# Altium schematic sheet Calculator.SchDoc
size A
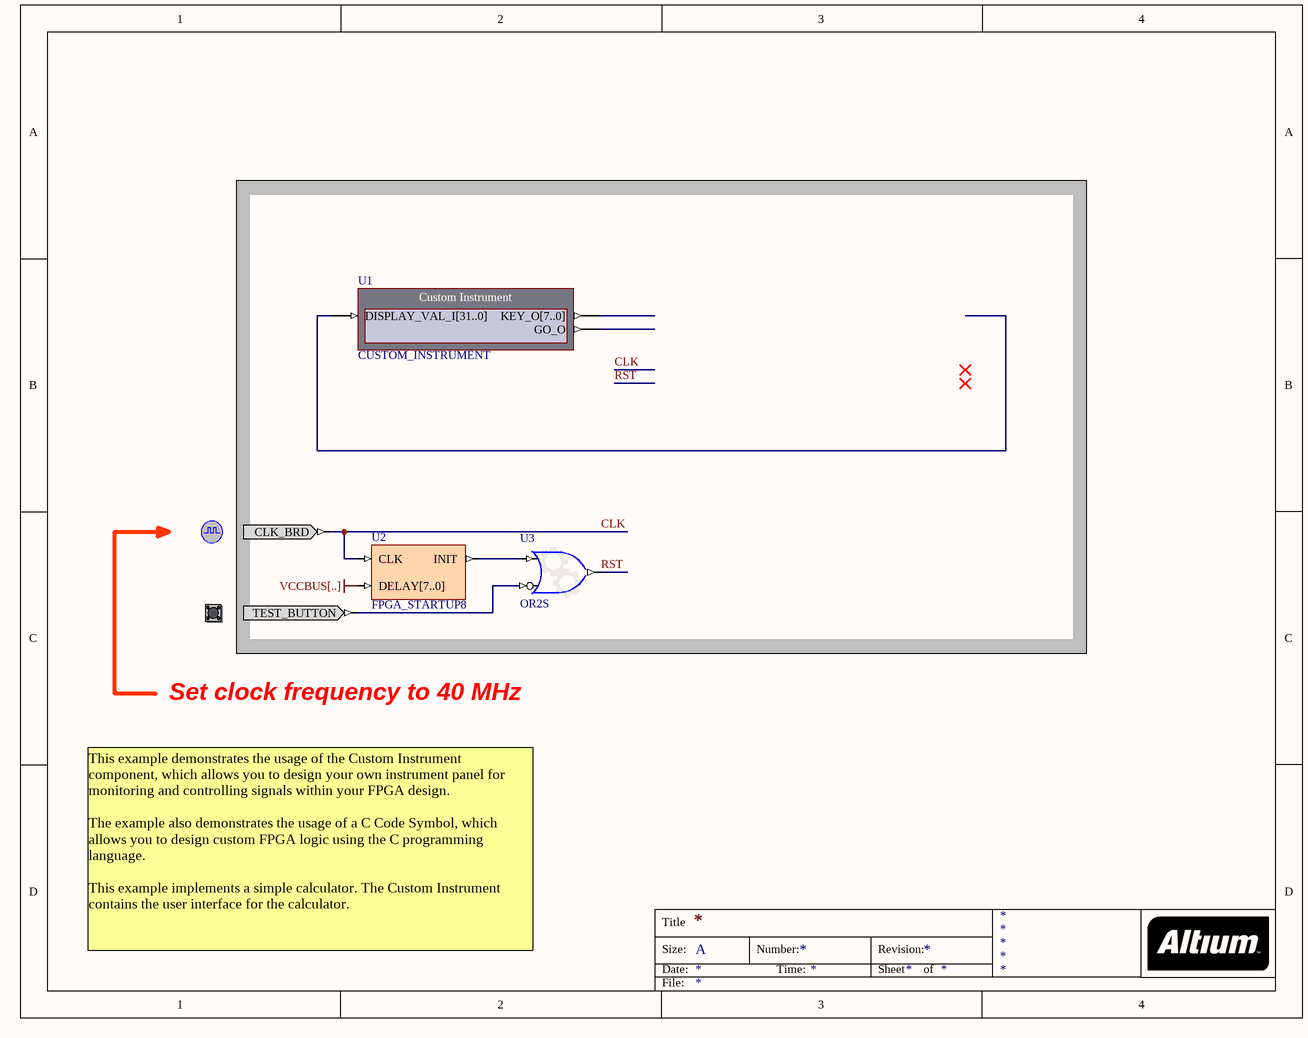
[diagram p0: Calculator.SchDoc]

## Parts
(Parts that share a designator on the sheet are numbered #1, #2 ... from top to bottom, then left to right.)
?#1  CLOCK_BOARD  (value not drawn)
?#2  TEST_BUTTON  (value not drawn)
U1  CUSTOM_INSTRUMENT
U2  FPGA_STARTUP8
U3  OR2S

## Nets
VCCBUS[..]: U2.DELAY[7..0]
CLK: ?#1.CLK_BRD U2.CLK
RST: U3.O
Net?#2_TEST_BUTTON: ?#2.TEST_BUTTON U3.I1
NetU2_INIT: U2.INIT U3.I0

Not connected (* = marked no-connect by the designer): U1 DISPLAY_VAL_I[31..0] GO_O KEY_O[7..0]

## Notes on the sheet
- Set clock frequency to 40 MHz
- This example demonstrates the usage of the Custom Instrument component, which allows you to design your own instrument panel for monitoring and controlling signals within your FPGA design.
  The example also demonstrates the usage of a C Code Symbol, which allows you to design custom FPGA logic using the C programming language.
  This example implements a simple calculator. The Custom Instrument contains the user interface for the calculator.
- Title
- Size:
- Date:
- A
- Number:
- Time:
- Revision:
- Sheet
- of
- File:

## Library data of the parts
?#1 = CLOCK_BOARD: Global System Clock Supply; PortComponent: True; Published: 19-Nov-2003; Publisher: Altium Limited; HelpURL: TR0143 Technical Reference Manual for Altium's Desktop NanoBoard NB2DSK01.pdf#page=41; UseInDSF: True
?#2 = TEST_BUTTON: Test / Reset Button; PortComponent: True; Published: 19-Nov-2003; Publisher: Altium Limited; HelpURL: TR0143 Technical Reference Manual for Altium's Desktop NanoBoard NB2DSK01.pdf#page=53
U1 = CUSTOM_INSTRUMENT: Custom Instrument; NEXUS_JTAG_DEVICE: True; NEXUS_JTAG_ORDER: 0; ConfigurationParameters: {}Version[1.0]{}Storage[Calculator U1.Instrument]{}StorageType[0]{}RackTitle[Calculator]{}ShowOptionsButton[True]{}ShowSyncButton[True]{}SchCompWidth[160]{}CustomPanelViewer[False]{}InterfaceType[Parallel]{}ID[0]{}AutoShow[True]{}DisabledInDashboard[False]{}Input0Name[DISPLAY_VAL_I{1}31..0{2}]{}Input0Width[32]{}Input0InitValue[0]{}Output0Name[KEY_O{1}7..0{2}]{}Output0Width[8]{}Output0InitValue[0]{}Output1Name[GO_O]{}Output1Width[1]{}Output1InitValue[0]{}UseBitmap[False]{}Code_Len[548]{}Code_Data[78DACD98416FDA3014C7EF487C07DF0A97881020D0AA87101842A30B6A22AAAA9A2C93BC316FA9C38C33896F3F3B218CB4930A1CA6E713FC709EFFEF871329F633B153CD06D1239EF00D57B443C83DE9DCD5986D985D675DC3BA75E618E6D459CFB05E9DF50DEBD7D9C0B0419DB986B97536346C586723C34615F392841443673E3612E66B2559AC0C3C76F290A78A6FD3BD8127ADFCE60994971F7B99FECA59BA2BE1B1193F05260F0B996E9A8D1593E56F41AEB6B97A925C2910E4968CB34C4F16C5A4A5CC62487209249AC08E6F04249E04B6640252EB1DA18FC01253085A218804A4AE1605EB1F10ABB62E37860D17FF5CF39E44328743D6055BEB5213BEDBA66CBF62690E96CFB68A67C5C4B95051162AD90AF5DA2C7D60826D405A33502518EFBFB05768DD4CE6E172E13DD395B7A0F317C7B6ACCED79BB655D43361A622B9A6435F7FBABEBDB3168DF82B483ACB1E61078A16DF3E5A6FFEEDCD929E48C8478666010D2A23665BB449F41D0E05CDB8E4F2DBF23E3CABBF71AE54266887FA298F7F5EDCDADF9027B3CEC8FB79FA4C8317F7741F98D8D5A3E4EEEAC6ED934BDFFDF19FF4AD586D6C6DE73245362A453646455D548ABA181539A814391815F55029EA6154D447A5A88F51D10095A20146452E2A452E464543548A8618158D50291A6154A45F2C9148D249300AAA5EB29158AAE26054551D3D205155C5C1A8AA3C9041F3783261306A2A8FA890682AC360D4541CDA21B15464F9DF929A8D3FAADF8CB3]{}Design_Len[811]{}Design_Data[78DAD5D84F6FD3301400F03B12DFC1B74AC020FF9AA6483B74EDC686C698DAC00E08555EE3AE666E5C1C67503E3D769C6449BA60929D7CA9E4F7ECC4FDE5254D1FBDFD81561CCC5082EF62144D1882D73046E43D080F622F5F00708323BE01C7C0F73C393C47F86EC3C5D8F687727C4663FE76BA812C41323A3B3D9B7CB90C97D3F3C97C711A3ECEA08432915F911B1C47F457887EF332591EF3C8B6CBE015DC22111A847043B77050C6177C4F64E2DB7719FA1C4FC566B90C1CEC7EA9526ADA1CC1E886E1969965564EA64AE812DECA6340B24A09E49409A08B38E12CDDA29867493919804BB4CE3C2C4F8D43BA1343271F157C8E1DA840F96587B60A4CE18E631ACBEFFA78B2419E2BD9CEC52A2257AA849EBD016FBB81B862AE55493DB2BBA34AB8809F300C09382170753FA8A4EBFE005C43263C8AD39C4192A06A42AEA9C74306E36497254522646916477154B13F4939A7F172543357C11ABAEB0755F4A06EEE3A0DF22250211F0D7A82362BF9B096C73D50D7C90925D11BB04E2E38247895238B3217837B31A3905966815639AFA39CD783CE3393CED3D0D95D8BAE079D6D269DADA10B74749EF5DCFB3530532ED0C88DB572DE73E5C666CA8D3572C38E35D7E7493734936EA8A1F33B165D1F3ADF4C3A5F43E7747DD2F5A073CCA47334746ED7475D0F3AD74C3A574367757C35B19D1E7696997696C6EEF4672AFE8374ACBD5E80C766022A208DE20C3FE008691583E7BEACBC33D350F1680C3FA584E31DD97754ECF3EBFBCA4CC6424803B9486F39832BDEB51C7B401E9909590869202751D4D1B0D783F1B599884247E3372508B28E6F84BD04A7660A663E6D86AA033BC3C98EC0FA33B1EC41B735599B77B27360E8E50DCFFCF0C5CEA3E40383FB6A9FB231A1D2AFACB583F3695F2149515B43B8DC6D508CD56EAD6278D0137E62C3004C08BE8BB7AA4BCAE15CE63FA609C7EB7D3923E57481FF34F6FBE4CB5CB5957C45E372EAFF1452A394DCB1371A06562D5769253BB544AD9206B554B391FC8F56727B33B9AD9D9C5D05B8A769A647A6228B984AE4D5572FC2106F115B7EA0732420C485CDC66AFE855CFA20EE03517E457D676979BAEAB26565515E01FE93F77C76EAECE32FB26A21F2]{}; NEXUS_CORE: Instrument; ConfiguratorName: CUSTOM_INSTRUMENT; ComponentLink1Description: Core &Resource Usage; ComponentLink1URL: CR0134 FPGA Instrument Resource Usage.pdf; Core Revision: 1.00.00; LastRevisionNo: 1.00.00; Published: 08-Apr-2008; Publisher: Altium Limited
U2 = FPGA_STARTUP8: FPGA Startup With 8 Bit Delay; Published: 9-Dec-2004; Publisher: Altium Limited; HelpURL: CR0119 FPGA_STARTUPx Powerup Delay Unit.pdf; LastRevisionNo: 1.00.00; ComponentLink1Description: Core &Resource Usage; ComponentLink1URL: CR0139 FPGA Peripheral Resource Usage.pdf#page=11
U3 = GATE: Configurable Generic Gate; ConfiguratorName: GENERIC_GATE; ConfigurationParameters: {}Version[1.0]{}GateKind[OR]{}BusInput[False]{}GateInputType[Bit]{}GateOutputOption[Normal]{}BusWidth[8]{}RegisterOutputs[False]{}NegativeClockEdge[False]{}InputCount[2]{}InputInvert0[False]{}InputInvert1[True]{}; LastRevisionNo: 1.00.00; Published: 3-Sep-2008; Publisher: Altium Limited